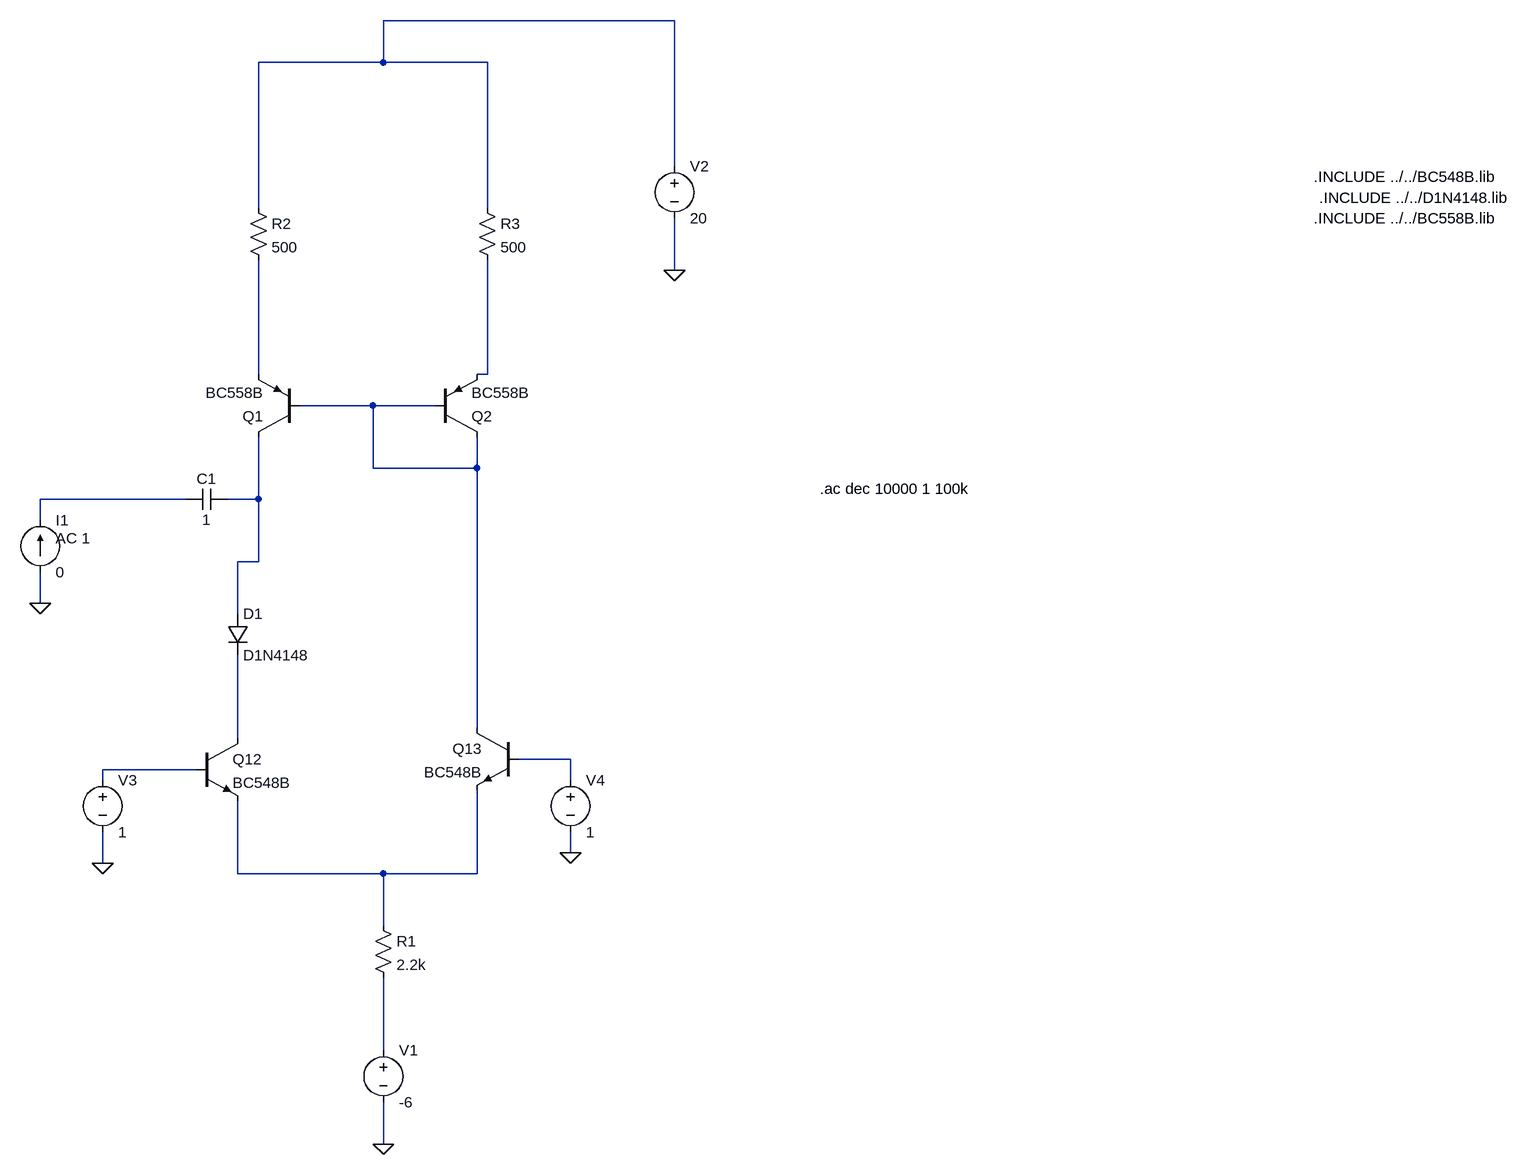
[diagram p0: schematic ro.asc]
ro.asc, the LTspice schematic file:
Version 4
SHEET 1 1888 936
WIRE 576 -832 128 -832
WIRE 128 -768 128 -832
WIRE 128 -768 -64 -768
WIRE 288 -768 128 -768
WIRE 576 -608 576 -832
WIRE -64 -544 -64 -768
WIRE 288 -544 288 -768
WIRE 576 -448 576 -528
WIRE -64 -288 -64 -464
WIRE 288 -288 288 -464
WIRE 288 -288 272 -288
WIRE 112 -240 0 -240
WIRE 208 -240 112 -240
WIRE 112 -144 112 -240
WIRE 272 -144 272 -192
WIRE 272 -144 112 -144
WIRE -176 -96 -400 -96
WIRE -64 -96 -64 -192
WIRE -64 -96 -112 -96
WIRE -400 -64 -400 -96
WIRE -64 0 -64 -96
WIRE -64 0 -96 0
WIRE -400 64 -400 16
WIRE -96 80 -96 0
WIRE 272 256 272 -144
WIRE -96 272 -96 144
WIRE 416 304 336 304
WIRE -160 320 -304 320
WIRE -304 336 -304 320
WIRE 416 336 416 304
WIRE 416 448 416 416
WIRE -304 464 -304 416
WIRE -96 480 -96 368
WIRE 128 480 -96 480
WIRE 272 480 272 352
WIRE 272 480 128 480
WIRE 128 560 128 480
WIRE 128 752 128 640
WIRE 128 896 128 832
FLAG 128 896 0
FLAG 576 -448 0
FLAG -304 464 0
FLAG -400 64 0
FLAG 416 448 0
SYMBOL pnp 0 -192 R180
SYMATTR InstName Q1
SYMATTR Value BC558B
SYMBOL pnp 208 -192 M180
SYMATTR InstName Q2
SYMATTR Value BC558B
SYMBOL res -80 -560 R0
SYMATTR InstName R2
SYMATTR Value 500
SYMBOL res 272 -560 R0
SYMATTR InstName R3
SYMATTR Value 500
SYMBOL res 112 544 R0
SYMATTR InstName R1
SYMATTR Value 2.2k
SYMBOL voltage 128 736 R0
WINDOW 123 0 0 Left 0
WINDOW 39 0 0 Left 0
SYMATTR InstName V1
SYMATTR Value -6
SYMBOL voltage 576 -624 R0
WINDOW 123 0 0 Left 0
WINDOW 39 0 0 Left 0
SYMATTR InstName V2
SYMATTR Value 20
SYMBOL npn 336 256 M0
SYMATTR InstName Q13
SYMATTR Value BC548B
SYMBOL npn -160 272 R0
SYMATTR InstName Q12
SYMATTR Value BC548B
SYMBOL diode -112 80 R0
SYMATTR InstName D1
SYMATTR Value D1N4148
SYMBOL cap -112 -112 R90
WINDOW 0 0 32 VBottom 2
WINDOW 3 32 32 VTop 2
SYMATTR InstName C1
SYMATTR Value 1
SYMBOL current -400 16 M180
WINDOW 0 24 80 Left 2
WINDOW 3 24 0 Left 2
WINDOW 123 24 52 Left 2
WINDOW 39 0 0 Left 0
SYMATTR InstName I1
SYMATTR Value 0
SYMATTR Value2 AC 1
SYMBOL voltage -304 320 R0
WINDOW 123 0 0 Left 0
WINDOW 39 0 0 Left 0
SYMATTR InstName V3
SYMATTR Value 1
SYMBOL voltage 416 320 R0
WINDOW 123 0 0 Left 0
WINDOW 39 0 0 Left 0
SYMATTR InstName V4
SYMATTR Value 1
TEXT 1560 -592 Left 2 !.INCLUDE ../../BC548B.lib
TEXT 1568 -560 Left 2 !.INCLUDE ../../D1N4148.lib
TEXT 1560 -528 Left 2 !.INCLUDE ../../BC558B.lib
TEXT 800 -112 Left 2 !.ac dec 10000 1 100k

The netlist it stands for:
* ro.asc
Q1 N006 N004 N002 0 BC558B
Q2 N004 N004 N003 0 BC558B
R2 N001 N002 500
R3 N001 N003 500
R1 N010 N011 2.2k
V1 N011 0 -6
V2 N001 0 20
Q13 N004 N008 N010 0 BC548B
Q12 N007 N009 N010 0 BC548B
D1 N006 N007 D1N4148
C1 N006 N005 1
I1 0 N005 0 AC 1
V3 N009 0 1
V4 N008 0 1
.model D D
.lib standard.dio
.model NPN NPN
.model PNP PNP
.lib standard.bjt
.INCLUDE ../../BC548B.lib
.INCLUDE ../../D1N4148.lib
.INCLUDE ../../BC558B.lib
.ac dec 10000 1 100k
.backanno
.end